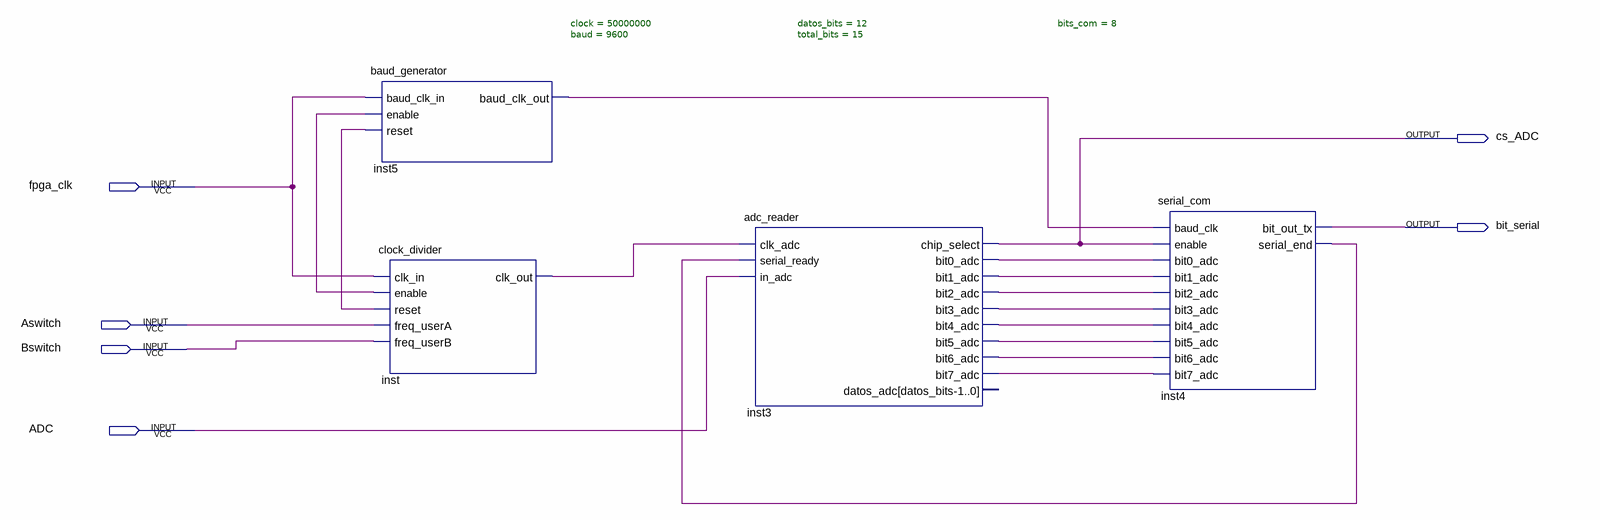
[diagram p0: schematic sheet]
// Quartus schematic Main_Block.bdf as structural Verilog: 4 symbols, 6 pins
module Main_Block (
  input  fpga_clk,
  input  Aswitch,
  input  Bswitch,
  input  ADC,
  output cs_ADC,
  output bit_serial
);

  wire inst3_bit0_adc, inst3_bit1_adc, inst3_bit2_adc, inst3_bit3_adc, inst3_bit4_adc, inst3_bit5_adc,
       inst3_bit6_adc, inst3_bit7_adc, inst4_serial_end, inst5_baud_clk_out, inst_clk_out, undriven,
       undriven_2;

  baud_generator #(.clock(50000000), .baud(9600)) inst5 (
    .baud_clk_in(fpga_clk), .enable(undriven_2), .reset(undriven), .baud_clk_out(inst5_baud_clk_out));
  clock_divider inst (
    .clk_in(fpga_clk), .enable(undriven_2), .reset(undriven), .freq_userA(Aswitch), .freq_userB(Bswitch),
    .clk_out(inst_clk_out));
  adc_reader #(.datos_bits(12), .total_bits(15)) inst3 (
    .clk_adc(inst_clk_out), .serial_ready(inst4_serial_end), .in_adc(ADC), .chip_select(cs_ADC),
    .bit0_adc(inst3_bit0_adc), .bit1_adc(inst3_bit1_adc), .bit2_adc(inst3_bit2_adc),
    .bit3_adc(inst3_bit3_adc), .bit4_adc(inst3_bit4_adc), .bit5_adc(inst3_bit5_adc),
    .bit6_adc(inst3_bit6_adc), .bit7_adc(inst3_bit7_adc));  // open: datos_adc
  serial_com #(.bits_com(8)) inst4 (
    .baud_clk(inst5_baud_clk_out), .enable(cs_ADC), .bit0_adc(inst3_bit0_adc), .bit1_adc(inst3_bit1_adc),
    .bit2_adc(inst3_bit2_adc), .bit3_adc(inst3_bit3_adc), .bit4_adc(inst3_bit4_adc),
    .bit5_adc(inst3_bit5_adc), .bit6_adc(inst3_bit6_adc), .bit7_adc(inst3_bit7_adc), .bit_out_tx(bit_serial),
    .serial_end(inst4_serial_end));
endmodule
